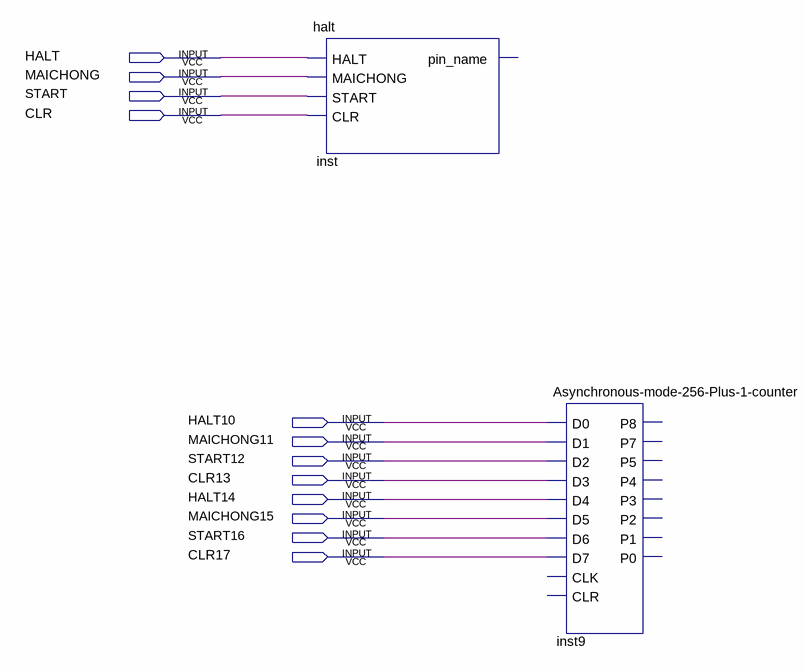
[diagram p0: schematic sheet]
// Quartus schematic MicroMemCtrl.bdf as structural Verilog: 2 symbols, 12 pins
module MicroMemCtrl (
  input  HALT,
  input  MAICHONG,
  input  START,
  input  CLR,
  input  HALT10,
  input  MAICHONG11,
  input  START12,
  input  CLR13,
  input  HALT14,
  input  MAICHONG15,
  input  START16,
  input  CLR17
);

  halt inst (.HALT(HALT), .MAICHONG(MAICHONG), .START(START), .CLR(CLR));  // open: pin_name
  \Asynchronous-mode-256-Plus-1-counter  inst9 (
    .D0(HALT10), .D1(MAICHONG11), .D2(START12), .D3(CLR13), .D4(HALT14), .D5(MAICHONG15), .D6(START16),
    .D7(CLR17));  // open: CLK, CLR, P8, P7, P5, P4, P3, P2, P1, P0
endmodule
